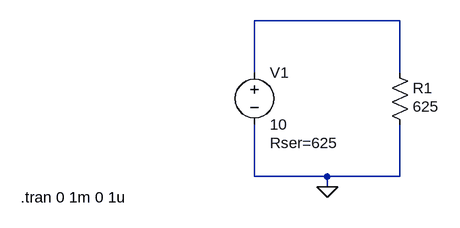
[diagram p0: schematic схема_лаб1.asc]
схема_лаб1.asc, the LTspice schematic file:
Version 4.1
SHEET 1 880 680
WIRE -16 96 -240 96
WIRE -240 176 -240 96
WIRE -16 176 -16 96
WIRE -240 336 -240 256
WIRE -128 336 -240 336
WIRE -16 336 -16 256
WIRE -16 336 -128 336
WIRE -128 352 -128 336
FLAG -128 352 0
SYMBOL voltage -240 160 R0
WINDOW 123 0 0 Left 0
WINDOW 39 24 124 Left 2
SYMATTR InstName V1
SYMATTR Value 10
SYMATTR SpiceLine Rser=625
SYMBOL res -32 160 R0
WINDOW 3 36 68 Left 2
SYMATTR InstName R1
SYMATTR Value 625
TEXT -600 368 Left 2 !.tran 0 1m 0 1u

The netlist it stands for:
* схема_лаб1.asc
V1 N001 0 10 Rser=625
R1 N001 0 625
.tran 0 1m 0 1u
.backanno
.end